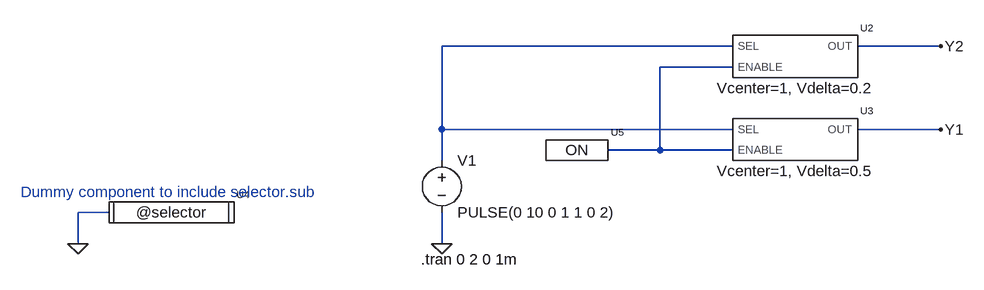
[diagram p0: schematic selector-element.test.asc]
selector-element.test.asc, the LTspice schematic file:
Version 4
SHEET 1 908 680
WIRE 400 48 -48 48
WIRE 720 48 592 48
WIRE 400 80 288 80
WIRE -48 176 -48 48
WIRE 400 176 -48 176
WIRE 720 176 592 176
WIRE 288 208 288 80
WIRE 288 208 208 208
WIRE 400 208 288 208
WIRE -48 224 -48 176
WIRE -560 304 -608 304
WIRE -608 352 -608 304
WIRE -48 352 -48 304
FLAG -48 352 0
FLAG 720 176 Y1
FLAG 720 48 Y2
FLAG -608 352 0
SYMBOL voltage -48 208 R0
WINDOW 123 0 0 Left 2
WINDOW 39 0 0 Left 2
SYMATTR InstName V1
SYMATTR Value PULSE(0 10 0 1 1 0 2)
SYMBOL selector-element 496 64 R0
SYMATTR SpiceLine Vcenter=1, Vdelta=0.2
SYMATTR InstName U2
SYMBOL selector-element 496 192 R0
SYMATTR InstName U3
SYMBOL @selector -464 304 R0
SYMATTR InstName U4
SYMBOL selector-on 160 208 R0
SYMATTR InstName U5
TEXT -80 376 Left 2 !.tran 0 2 0 1m
TEXT -696 272 Left 2 ;Dummy component to include selector.sub

The netlist it stands for:
* selector-element.test.asc
V1 N001 0 PULSE(0 10 0 1 1 0 2)
XU2 N001 N002 Y2 selector-element Vcenter=1, Vdelta=0.2  ; pins SEL ENABLE OUT
XU3 N001 N002 Y1 selector-element Vcenter=1, Vdelta=0.5  ; pins SEL ENABLE OUT
XU4 0 @selector
XU5 N002 selector-on  ; pins OUT
.tran 0 2 0 1m
* Dummy component to include selector.sub
.lib selector.sub
.backanno
.end